# Altium schematic sheet [08] - SD_Card and Ethernet.SchDoc
size A3; DocumentNumber: 3; SheetNumber: 3; SheetTotal: 4
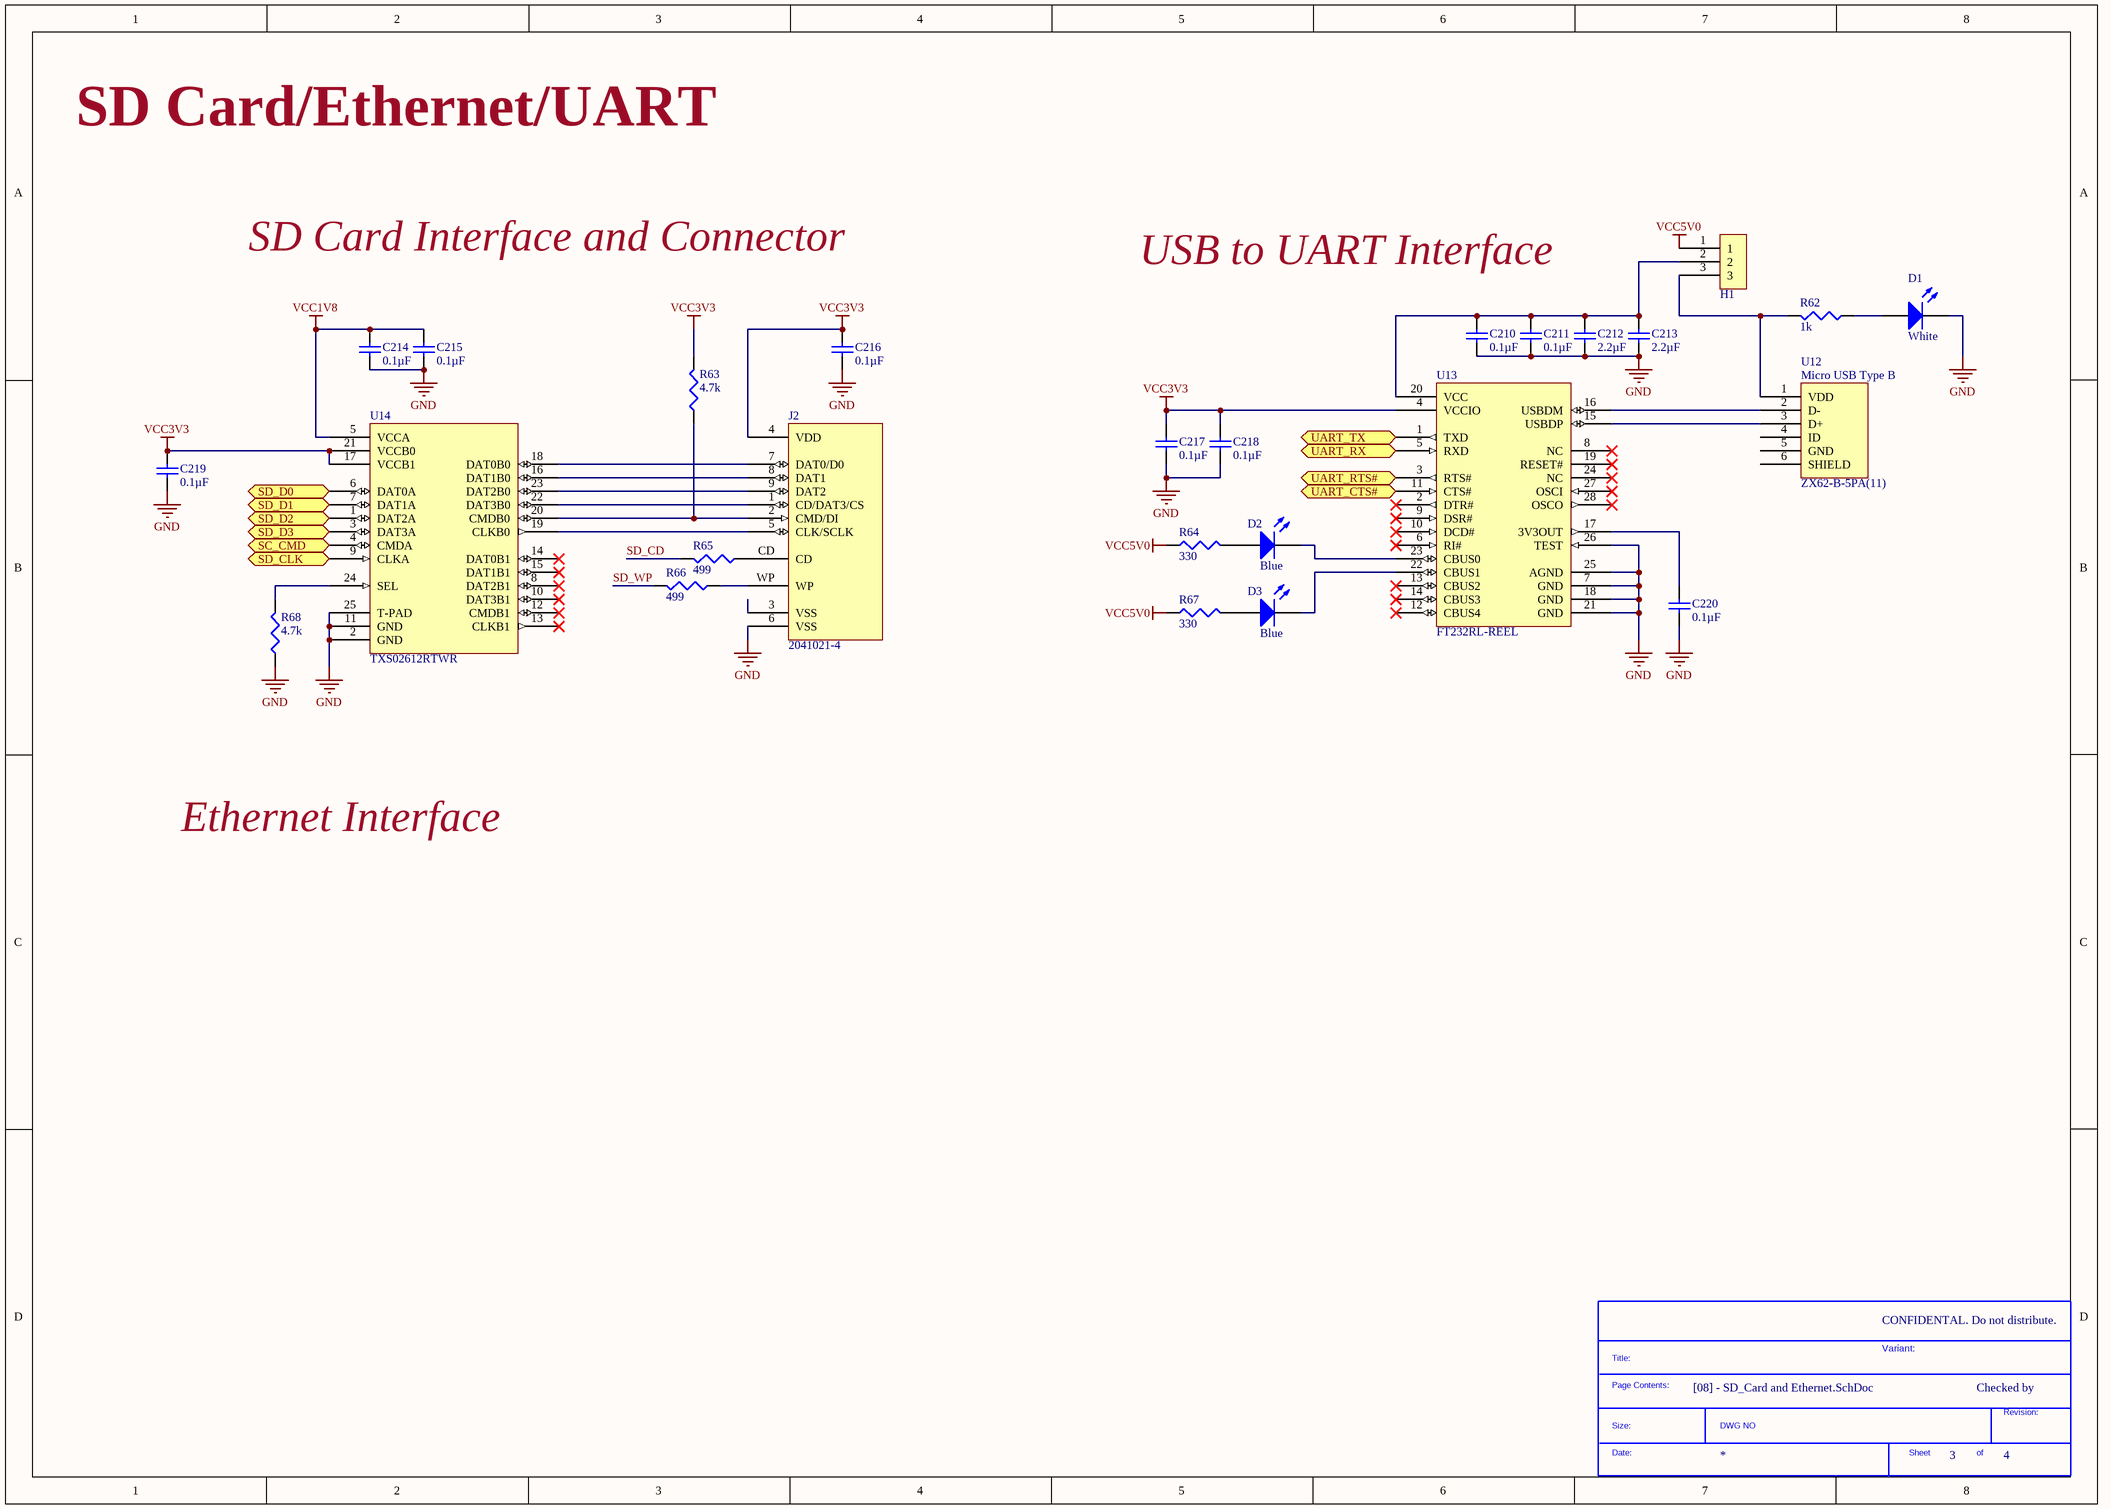
[diagram p0: [08] - SD_Card and Ethernet.SchDoc]

## Parts
*  SDTitleBlock  (value not drawn)  (graphical)
C210  Capacitance: 0.1µF  [CAP-0603]  (hidden comment: GRM188R71C104KA01D)
C211  Capacitance: 0.1µF  [CAP-0603]  (hidden comment: GRM188R71C104KA01D)
C212  Capacitance: 2.2µF  [CAP-0603]  (hidden comment: GRM188R71A225KE15D)
C213  Capacitance: 2.2µF  [CAP-0603]  (hidden comment: GRM188R71A225KE15D)
C214  Capacitance: 0.1µF  [CAP-0402]  (hidden comment: CGA2B1X7R1C104K050BC)
C215  Capacitance: 0.1µF  [CAP-0402]  (hidden comment: CGA2B1X7R1C104K050BC)
C216  Capacitance: 0.1µF  [CAP-0402]  (hidden comment: CGA2B1X7R1C104K050BC)
C217  Capacitance: 0.1µF  [CAP-0603]  (hidden comment: GRM188R71C104KA01D)
C218  Capacitance: 0.1µF  [CAP-0603]  (hidden comment: GRM188R71C104KA01D)
C219  Capacitance: 0.1µF  [CAP-0402]  (hidden comment: CGA2B1X7R1C104K050BC)
C220  Capacitance: 0.1µF  [CAP-0603]  (hidden comment: GRM188R71C104KA01D)
D1  Color: White  (hidden comment: SMLE12WBC7W1)
D2  Color: Blue  (hidden comment: LB Q39E-N1OO-35-1)
D3  Color: Blue  (hidden comment: LB Q39E-N1OO-35-1)
H1  68001-203HLF  (value not drawn)
J2  2041021-4
R62  Resistance (Ohms): 1k  [R0603]  (hidden comment: ERJ-3EKF1001V)
R63  Resistance (Ohms): 4.7k  [R0603]  (hidden comment: ERJ-3EKF4701V)
R64  Resistance (Ohms): 330  [R0603]  (hidden comment: ERJ-3EKF3300V)
R65  Resistance (Ohms): 499  [CAP-0603]  (hidden comment: ERJ-3EKF4990V)
R66  Resistance (Ohms): 499  [CAP-0603]  (hidden comment: ERJ-3EKF4990V)
R67  Resistance (Ohms): 330  [R0603]  (hidden comment: ERJ-3EKF3300V)
R68  Resistance (Ohms): 4.7k  [R0603]  (hidden comment: ERJ-3EKF4701V)
U12  ZX62-B-5PA(11)
U13  FT232RL-REEL
U14  TXS02612RTWR

## Ports
SC_CMD (bidir), SD_CLK (bidir), SD_D0 (bidir), SD_D1 (bidir), SD_D2 (bidir), SD_D3 (bidir), UART_CTS# (bidir), UART_RTS# (bidir), UART_RX (bidir), UART_TX (bidir)

## Nets
GND: C210.2 C211.2 C212.2 C213.2 C214.2 C215.2 C216.2 C217.2 C218.2 C219.2 C220.2 D1.2(K) J2.6(VSS) R68.1 U13.7(GND) U13.18(GND) U13.21(GND) U13.25(AGND) U13.26(TEST) U14.2(GND) U14.11(GND) U14.25(T-PAD)
VCC1V8: C214.1 C215.1 U14.5(VCCA)
VCC3V3: C216.1 C217.1 C218.1 C219.1 J2.4(VDD) R63.2 U13.4(VCCIO) U14.17(VCCB1) U14.21(VCCB0)
VCC5V0: H1.1 R64.1 R67.1
SC_CMD: U14.4(CMDA) ; port SC_CMD
SD_CD: R65.2
SD_CLK: U14.9(CLKA) ; port SD_CLK
SD_D0: U14.6(DAT0A) ; port SD_D0
SD_D1: U14.7(DAT1A) ; port SD_D1
SD_D2: U14.1(DAT2A) ; port SD_D2
SD_D3: U14.3(DAT3A) ; port SD_D3
SD_WP: R66.2
UART_CTS#: U13.11(CTS#) ; port UART_CTS#
UART_RTS#: U13.3(RTS#) ; port UART_RTS#
UART_RX: U13.5(RXD) ; port UART_RX
UART_TX: U13.1(TXD) ; port UART_TX
NetC210_1: C210.1 C211.1 C212.1 C213.1 H1.2 U13.20(VCC)
NetC220_1: C220.1 U13.17(3V3OUT)
NetD1_1: D1.1(A) R62.1
NetD2_1: D2.1(A) R64.2
NetD2_2: D2.2(K) U13.23(CBUS0)
NetD3_1: D3.1(A) R67.2
NetD3_2: D3.2(K) U13.22(CBUS1)
NetH1_3: H1.3 R62.2 U12.1(VDD)
NetJ2_1: J2.1(CD/DAT3/CS) U14.22(DAT3B0)
NetJ2_2: J2.2(CMD/DI) R63.1 U14.20(CMDB0)
NetJ2_5: J2.5(CLK/SCLK) U14.19(CLKB0)
NetJ2_7: J2.7(DAT0/D0) U14.18(DAT0B0)
NetJ2_8: J2.8(DAT1) U14.16(DAT1B0)
NetJ2_9: J2.9(DAT2) U14.23(DAT2B0)
NetJ2_CD: J2.CD R65.1
NetJ2_WP: J2.WP R66.1
NetR68_2: R68.2 U14.24(SEL)
NetU12_2: U12.2(D-) U13.16(USBDM)
NetU12_3: U12.3(D+) U13.15(USBDP)

Not connected (* = marked no-connect by the designer): J2 3(VSS); U12 4(ID) 5(GND) 6(SHIELD); U13 2(DTR#)* 6(RI#)* 8(NC)* 9(DSR#)* 10(DCD#)* 12(CBUS4)* 13(CBUS2)* 14(CBUS3)* 19(RESET#)* 24(NC)* 27(OSCI)* 28(OSCO)*; U14 8(DAT2B1)* 10(DAT3B1)* 12(CMDB1)* 13(CLKB1)* 14(DAT0B1)* 15(DAT1B1)*

## Notes on the sheet
- SD Card/Ethernet/UART
- SD Card Interface and Connector
- USB to UART Interface
- Ethernet Interface
- CONFIDENTAL. Do not distribute.
- Variant:
- Checked by
- (in symbol SDTitleBlock) Title:; Page Contents:; Revision:; Size:; DWG NO; Date:; Sheet; of
- (in symbol ZX62-B-5PA(11)) Micro USB Type B

## Library data of the parts
C210 C211 C217 C218 C220 = GRM188R71C104KA01D: CAP CER 0.1UF 16V X7R 0603; Manufacturer: Murata Electronics North America; Tolerance: ±10%; Supplier 1: Digi-Key; Manufacturer Part Number: GRM188R71C104KA01D; RoHS: RoHS Compliant; Category: Capacitors; Stock 1: 3229528; Pricing 1: 1=0.1, 10=0.019, 50=0.0102, 100=0.0086, 250=0.00704, 500=0.006, 1000=0.00468 (USD); Packaging: Cut Tape (CT); Voltage - Rated: 16V; Temperature Coefficient: X7R; Mounting Type: Surface Mount, MLCC; Operating Temperature: -55°C ~ 125°C; Applications: General Purpose; Ratings: -; Package / Case: 0603 (1608 Metric); Size / Dimension: 0.063" L x 0.031" W (1.60mm x 0.80mm); Height - Seated (Max): -; Thickness (Max): 0.035" (0.90mm); Lead Spacing: -; Features: -; Lead Style: -; ComponentLink1URL: http://www.murata.com/~/media/webrenewal/support/library/catalog/products/capacitor/mlcc/c02e.pdf; ComponentLink1Description: http://www.murata.com/~/media/webrenewal/support/library/catalog/products/capacitor/mlcc/c02e.pdf; Supplier Part Number 1: 490-1532-1-ND
C212 C213 = GRM188R71A225KE15D: CAP CER 2.2UF 10V X7R 0603; Manufacturer: Murata Electronics North America; Tolerance: ±10%; Supplier 1: Digi-Key; Manufacturer Part Number: GRM188R71A225KE15D; RoHS: RoHS Compliant; Category: Capacitors; Stock 1: 191595; Pricing 1: 1=0.34, 10=0.28, 50=0.1576, 100=0.14, 250=0.105, 500=0.09276, 1000=0.08225 (USD); Packaging: Cut Tape (CT); Voltage - Rated: 10V; Temperature Coefficient: X7R; Mounting Type: Surface Mount, MLCC; Operating Temperature: -55°C ~ 125°C; Applications: General Purpose; Ratings: -; Package / Case: 0603 (1608 Metric); Size / Dimension: 0.063" L x 0.031" W (1.60mm x 0.80mm); Height - Seated (Max): -; Thickness (Max): 0.035" (0.90mm); Lead Spacing: -; Features: -; Lead Style: -; ComponentLink1URL: http://www.murata.com/~/media/webrenewal/support/library/catalog/products/capacitor/mlcc/c02e.pdf; ComponentLink1Description: http://www.murata.com/~/media/webrenewal/support/library/catalog/products/capacitor/mlcc/c02e.pdf; Supplier Part Number 1: 490-4520-1-ND
C214-C216 C219 = CGA2B1X7R1C104K050BC: CAP CER 0.1UF 16V X7R 0402; Manufacturer: TDK Corporation; Tolerance: ±10%; Supplier 1: Digi-Key; Manufacturer Part Number: CGA2B1X7R1C104K050BC; RoHS: RoHS Compliant; Category: Capacitors; Stock 1: 413079; Pricing 1: 1=0.1, 10=0.042, 100=0.0193, 250=0.01576, 500=0.01348, 1000=0.0105, 5000=0.00875 (USD); Packaging: Cut Tape (CT); Voltage - Rated: 16V; Temperature Coefficient: X7R; Mounting Type: Surface Mount, MLCC; Operating Temperature: -55°C ~ 125°C; Applications: Automotive; Ratings: AEC-Q200; Package / Case: 0402 (1005 Metric); Size / Dimension: 0.039" L x 0.020" W (1.00mm x 0.50mm); Height - Seated (Max): -; Thickness (Max): 0.022" (0.55mm); Lead Spacing: -; Features: -; Lead Style: -; ComponentLink1URL: https://product.tdk.com/info/en/catalog/datasheets/mlcc_automotive_general_en.pdf; ComponentLink1Description: https://product.tdk.com/info/en/catalog/datasheets/mlcc_automotive_general_en.pdf; Supplier Part Number 1: 445-5613-1-ND
D1 = SMLE12WBC7W1: LED WHITE DIFFUSED 0603 SMD; Manufacturer: Rohm Semiconductor; Millicandela Rating: 71mcd; Lens Style/Size: Rectangle with Flat Top, 1.20mm x 0.80mm; Voltage - Forward (Vf) (Typ): 2.9V; Current - Test: 5mA; Supplier 1: Digi-Key; Manufacturer Part Number: SMLE12WBC7W1; RoHS: RoHS Compliant; Category: Optoelectronics; Stock 1: 29713; Pricing 1: 1=0.75, 10=0.578, 25=0.48, 100=0.4125, 250=0.36, 500=0.315, 1000=0.2475, 2500=0.225 (USD); Packaging: Cut Tape (CT); Lens Color: White; Lens Transparency: Diffused; Viewing Angle: -; Mounting Type: Surface Mount; Wavelength - Dominant: -; Wavelength - Peak: -; Features: -; Package / Case: 0603 (1608 Metric); Supplier Device Package: 0603 (1608 Metric); Size / Dimension: 1.60mm L x 0.80mm W; Height (Max): 0.46mm; ComponentLink1URL: http://rohmfs.rohm.com/en/products/databook/datasheet/opto/led/chip_mono/sml-e1.pdf; ComponentLink1Description: http://rohmfs.rohm.com/en/products/databook/datasheet/opto/led/chip_mono/sml-e1.pdf; Supplier Part Number 1: 511-1602-1-ND
D2 D3 = LB Q39E-N1OO-35-1: LED BLUE DIFFUSED 0603 SMD; Manufacturer: OSRAM Opto Semiconductors Inc.; Lens Color: White; Millicandela Rating: 42mcd; Lens Style/Size: Rectangle with Flat Top, 1.10mm x 0.80mm; Voltage - Forward (Vf) (Typ): 2.85V; Current - Test: 5mA; Viewing Angle: 170°, 130°; Wavelength - Dominant: 470nm; Wavelength - Peak: 465nm; Supplier 1: Digi-Key; Manufacturer Part Number: LB Q39E-N1OO-35-1; RoHS: RoHS Compliant; Category: Optoelectronics; Stock 1: 39129; Pricing 1: 1=0.35, 10=0.268, 25=0.2184, 100=0.1736, 250=0.1488, 500=0.12896, 1000=0.0992 (USD); Packaging: Cut Tape (CT); Lens Transparency: Diffused; Mounting Type: Surface Mount; Features: -; Package / Case: 0603 (1608 Metric); Supplier Device Package: *; Size / Dimension: 1.60mm L x 0.80mm W; Height (Max): 0.40mm; ComponentLink1URL: http://www.osram-os.com/Graphics/XPic5/00124611_0.pdf; ComponentLink1Description: http://www.osram-os.com/Graphics/XPic5/00124611_0.pdf; Supplier Part Number 1: 475-2815-1-ND
H1 = 68001-203HLF: BERGSTIK II .100" SR STRAIGHT; Manufacturer: Amphenol FCI; Connector Type: Header, Unshrouded; Number of Positions: 3; Number of Positions Loaded: All; Pitch: 0.100" (2.54mm); Supplier 1: Digi-Key; Manufacturer Part Number: 68001-203HLF; RoHS: RoHS Compliant; Category: Connectors, Interconnects; Stock 1: 7857; Pricing 1: 1=0.19, 10=0.182, 25=0.1556, 50=0.136, 100=0.1264, 250=0.1118, 500=0.10692, 1000=0.08748, 2500=0.08019 (USD); Packaging: Bulk; Contact Type: Male Pin; Number of Rows: 1; Row Spacing: -; Contact Mating Length: 0.230" (5.84mm); Mounting Type: Through Hole; Termination: Solder; Fastening Type: -; Features: -; Contact Finish: Gold or Gold, GXT™; Contact Finish Thickness: 15µin (0.38µm); Color: Black; ComponentLink1URL: http://portal.fciconnect.com/Comergent//fci/drawing/68000.pdf; ComponentLink1Description: http://portal.fciconnect.com/Comergent//fci/drawing/68000.pdf; Supplier Part Number 1: 609-3470-ND
J2 = 2041021-4: CONN SD CARD PUSH-PULL R/A SMD; Manufacturer: TE Connectivity AMP Connectors; Card Type: Secure Digital - SD; Number of Positions: 11 (9 + 2); Connector Type: Connector; Insertion, Removal Method: Push In, Pull Out; Supplier 1: Digi-Key; Manufacturer Part Number: 2041021-4; RoHS: RoHS Compliant; Category: Connectors, Interconnects; Stock 1: 3592; Pricing 1: 1=3.1, 25=2.76, 50=2.3, 100=2.07 (USD); Packaging: Cut Tape (CT); Ejector Side: -; Mounting Type: Surface Mount, Right Angle; Features: Board Guide, Switch; Height Above Board: 0.130" (3.30mm); Mounting Feature: Normal, Standard - Top; Contact Finish: Gold; Contact Finish Thickness: 10µin (0.25µm); ComponentLink1URL: http://www.te.com/commerce/DocumentDelivery/DDEController?Action=srchrtrv&DocNm=2041021&DocType=Customer+Drawing&DocLang=English; ComponentLink1Description: http://www.te.com/commerce/DocumentDelivery/DDEController?Action=srchrtrv&DocNm=2041021&DocType=Customer+Drawing&DocLang=English; Supplier Part Number 1: A101492CT-ND
R62 = ERJ-3EKF1001V: RES SMD 1K OHM 1% 1/10W 0603; Manufacturer: Panasonic Electronic Components; Power (Watts): 0.1W, 1/10W; Temperature Coefficient: ±100ppm/°C; Supplier 1: Digi-Key; Manufacturer Part Number: ERJ-3EKF1001V; RoHS: RoHS Compliant; Category: Resistors; Stock 1: 6439941; Pricing 1: 1=0.1, 50=0.0114, 100=0.0084, 250=0.00644, 500=0.00514, 1000=0.00379 (USD); Packaging: Cut Tape (CT); Tolerance: ±1%; Composition: Thick Film; Features: Automotive AEC-Q200; Operating Temperature: -55°C ~ 155°C; Package / Case: 0603 (1608 Metric); Supplier Device Package: 0603; Size / Dimension: 0.063" L x 0.031" W (1.60mm x 0.80mm); Height: 0.022" (0.55mm); Number of Terminations: 2; ComponentLink1URL: http://industrial.panasonic.com/www-cgi/jvcr13pz.cgi?E+PZ+3+AOA0002+ERJ3EKF1001V+7+WW; ComponentLink1Description: http://industrial.panasonic.com/www-cgi/jvcr13pz.cgi?E+PZ+3+AOA0002+ERJ3EKF1001V+7+WW; Supplier Part Number 1: P1.00KHCT-ND
R63 R68 = ERJ-3EKF4701V: RES SMD 4.7K OHM 1% 1/10W 0603; Manufacturer: Panasonic Electronic Components; Power (Watts): 0.1W, 1/10W; Temperature Coefficient: ±100ppm/°C; Supplier 1: Digi-Key; Manufacturer Part Number: ERJ-3EKF4701V; RoHS: RoHS Compliant; Category: Resistors; Stock 1: 3227786; Pricing 1: 1=0.1, 50=0.0114, 100=0.0084, 250=0.00644, 500=0.00514, 1000=0.00379 (USD); Packaging: Cut Tape (CT); Tolerance: ±1%; Composition: Thick Film; Features: Automotive AEC-Q200; Operating Temperature: -55°C ~ 155°C; Package / Case: 0603 (1608 Metric); Supplier Device Package: 0603; Size / Dimension: 0.063" L x 0.031" W (1.60mm x 0.80mm); Height: 0.022" (0.55mm); Number of Terminations: 2; ComponentLink1URL: http://industrial.panasonic.com/www-cgi/jvcr13pz.cgi?E+PZ+3+AOA0002+ERJ3EKF4701V+7+WW; ComponentLink1Description: http://industrial.panasonic.com/www-cgi/jvcr13pz.cgi?E+PZ+3+AOA0002+ERJ3EKF4701V+7+WW; Supplier Part Number 1: P4.70KHCT-ND
R64 R67 = ERJ-3EKF3300V: RES SMD 330 OHM 1% 1/10W 0603; Manufacturer: Panasonic Electronic Components; Power (Watts): 0.1W, 1/10W; Temperature Coefficient: ±100ppm/°C; Supplier 1: Digi-Key; Manufacturer Part Number: ERJ-3EKF3300V; RoHS: RoHS Compliant; Category: Resistors; Stock 1: 608815; Pricing 1: 1=0.1, 50=0.0114, 100=0.0084, 250=0.00644, 500=0.00514, 1000=0.00379 (USD); Packaging: Cut Tape (CT); Tolerance: ±1%; Composition: Thick Film; Features: Automotive AEC-Q200; Operating Temperature: -55°C ~ 155°C; Package / Case: 0603 (1608 Metric); Supplier Device Package: 0603; Size / Dimension: 0.063" L x 0.031" W (1.60mm x 0.80mm); Height: 0.022" (0.55mm); Number of Terminations: 2; ComponentLink1URL: http://industrial.panasonic.com/www-cgi/jvcr13pz.cgi?E+PZ+3+AOA0002+ERJ3EKF3300V+7+WW; ComponentLink1Description: http://industrial.panasonic.com/www-cgi/jvcr13pz.cgi?E+PZ+3+AOA0002+ERJ3EKF3300V+7+WW; Supplier Part Number 1: P330HCT-ND
R65 R66 = ERJ-3EKF4990V: RES SMD 499 OHM 1% 1/10W 0603; Manufacturer: Panasonic Electronic Components; Power (Watts): 0.1W, 1/10W; Temperature Coefficient: ±100ppm/°C; Supplier 1: Digi-Key; Manufacturer Part Number: ERJ-3EKF4990V; RoHS: RoHS Compliant; Category: Resistors; Stock 1: 801148; Pricing 1: 1=0.1, 50=0.0114, 100=0.0084, 250=0.00644, 500=0.00514, 1000=0.00379 (USD); Packaging: Cut Tape (CT); Tolerance: ±1%; Composition: Thick Film; Features: Automotive AEC-Q200; Operating Temperature: -55°C ~ 155°C; Package / Case: 0603 (1608 Metric); Supplier Device Package: 0603; Size / Dimension: 0.063" L x 0.031" W (1.60mm x 0.80mm); Height: 0.022" (0.55mm); Number of Terminations: 2; ComponentLink1URL: http://industrial.panasonic.com/www-cgi/jvcr13pz.cgi?E+PZ+3+AOA0002+ERJ3EKF4990V+7+WW; ComponentLink1Description: http://industrial.panasonic.com/www-cgi/jvcr13pz.cgi?E+PZ+3+AOA0002+ERJ3EKF4990V+7+WW; Supplier Part Number 1: P499HCT-ND
U12 = ZX62-B-5PA(11): CONN RCPT MICRO USB B SMD R/A; Manufacturer: Hirose Electric Co Ltd; Connector Type: USB - micro B; Number of Contacts: 5; Gender: Receptacle; Specifications: USB 2.0; Supplier 1: Digi-Key; Manufacturer Part Number: ZX62-B-5PA(11); RoHS: RoHS Compliant; Category: Connectors, Interconnects; Stock 1: 35202; Pricing 1: 1=0.96, 10=0.842, 25=0.792, 50=0.759, 100=0.726, 250=0.66, 500=0.594, 1000=0.528 (USD); Packaging: Cut Tape (CT); Mounting Type: Surface Mount, Right Angle, Horizontal; Features: -; Ingress Protection: -; ComponentLink1URL: http://www.hirose.co.jp/cataloge_hp/ed_ZX_20140804.pdf; ComponentLink1Description: http://www.hirose.co.jp/cataloge_hp/ed_ZX_20140804.pdf; Supplier Part Number 1: H11634CT-ND
U13 = FT232RL-REEL: IC USB FS SERIAL UART 28-SSOP; Manufacturer: FTDI, Future Technology Devices International Ltd; Function: Bridge, USB to UART; Standards: USB 2.0; Voltage - Supply: 3.3 V ~ 5.25 V; Current - Supply: 15mA; Supplier 1: Digi-Key; Manufacturer Part Number: FT232RL-REEL; RoHS: RoHS Compliant; Category: Integrated Circuits (ICs); Stock 1: 106715; Pricing 1: 1=4.5, 10=4.05, 50=3.85, 100=3.65, 250=3.25, 500=2.85 (USD); Packaging: Cut Tape (CT); Protocol: USB; Interface: UART; Operating Temperature: -40°C ~ 85°C; Package / Case: 28-SSOP (0.209", 5.30mm Width); Supplier Device Package: 28-SSOP; ComponentLink1URL: http://www.ftdichip.com/Support/Documents/DataSheets/ICs/DS_FT232R.pdf; ComponentLink1Description: http://www.ftdichip.com/Support/Documents/DataSheets/ICs/DS_FT232R.pdf; Supplier Part Number 1: 768-1007-1-ND
U14 = TXS02612RTWR: IC SDIO PORT EXPANDER 24WQFN; Manufacturer: Texas Instruments; Voltage - Supply: 1.1 V ~ 3.6 V; Supplier 1: Digi-Key; Manufacturer Part Number: TXS02612RTWR; RoHS: RoHS Compliant; Category: Integrated Circuits (ICs); Stock 1: 9728; Pricing 1: 1=1.6, 10=1.429, 100=1.1139, 500=0.9212, 1000=0.7285 (USD); Packaging: Cut Tape (CT); Applications: Cell Phone; Interface: SDIO; Package / Case: 24-WQFN Exposed Pad; Supplier Device Package: 24-WQFN (4x4); Mounting Type: Surface Mount; ComponentLink1URL: http://www.ti.com/lit/ds/symlink/txs02612.pdf; ComponentLink1Description: http://www.ti.com/lit/ds/symlink/txs02612.pdf; Supplier Part Number 1: 296-23869-1-ND